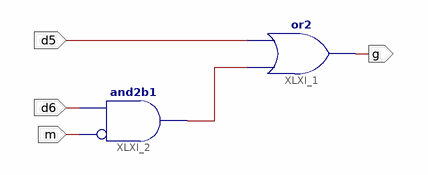
[diagram p0: schematic sheet 1]
// Xilinx ISE schematic gSSD.sch (xc9500xl) as structural Verilog: 2 symbols, 4 ports
module gSSD (
  input  d5,
  input  d6,
  input  m,
  output g
);

  wire XLXN_1;

  or XLXI_1 (g, XLXN_1, d5);
  and XLXI_2 (XLXN_1, ~m, d6);  // and2b1
endmodule
